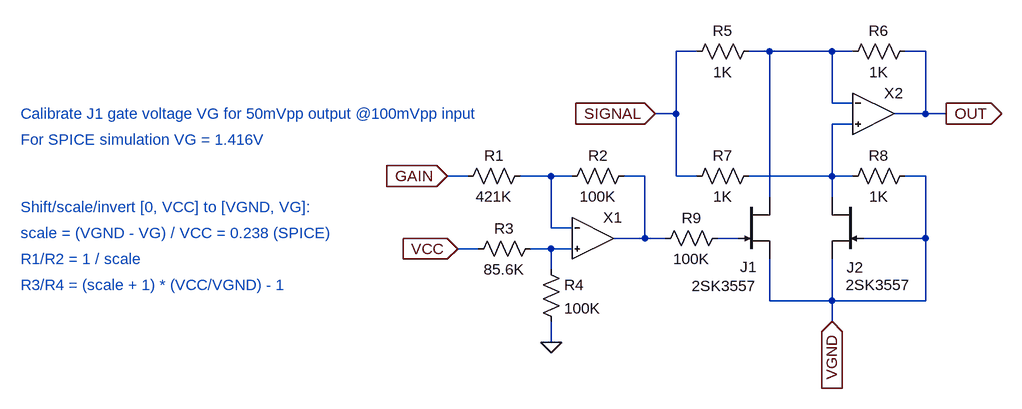
[diagram p0: schematic attenuator.asc]
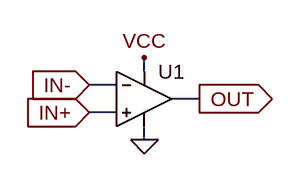
[diagram p1: sub-circuit opamp.asc]
attenuator.asc, the LTspice schematic file:
Version 4
SHEET 1 1100 728
WIRE -96 80 -128 80
WIRE 16 80 -16 80
WIRE 112 80 16 80
WIRE 144 80 112 80
WIRE 256 80 224 80
WIRE 112 160 112 80
WIRE 144 160 112 160
WIRE -128 176 -128 80
WIRE -128 176 -160 176
WIRE 256 176 256 80
WIRE 256 176 208 176
WIRE 288 176 256 176
WIRE 144 192 112 192
WIRE -448 272 -480 272
WIRE -320 272 -368 272
WIRE -288 272 -320 272
WIRE -176 272 -208 272
WIRE -128 272 -128 176
WIRE -96 272 -128 272
WIRE 112 272 112 192
WIRE 112 272 -16 272
WIRE 144 272 112 272
WIRE 256 272 224 272
WIRE 16 304 16 80
WIRE 112 304 112 272
WIRE -320 352 -320 272
WIRE -288 352 -320 352
WIRE -176 368 -176 272
WIRE -176 368 -224 368
WIRE -144 368 -176 368
WIRE -32 368 -64 368
WIRE 256 368 256 272
WIRE 256 368 160 368
WIRE -432 384 -464 384
WIRE -320 384 -352 384
WIRE -288 384 -320 384
WIRE -320 416 -320 384
WIRE 16 464 16 400
WIRE 112 464 112 400
WIRE 112 464 16 464
WIRE 256 464 256 368
WIRE 256 464 112 464
WIRE 112 496 112 464
WIRE -320 528 -320 496
FLAG 288 176 OUT
IOPIN 288 176 Out
FLAG -160 176 SIGNAL
IOPIN -160 176 In
FLAG -320 528 0
FLAG -480 272 GAIN
IOPIN -480 272 In
FLAG 112 496 VGND
IOPIN 112 496 In
FLAG -464 384 VCC
IOPIN -464 384 In
SYMBOL res 240 64 R90
WINDOW 0 0 56 VBottom 2
WINDOW 3 32 56 VTop 2
SYMATTR InstName R6
SYMATTR Value 1K
SYMBOL res 240 256 R90
WINDOW 0 0 56 VBottom 2
WINDOW 3 32 56 VTop 2
SYMATTR InstName R8
SYMATTR Value 1K
SYMBOL njf 160 304 M0
WINDOW 0 0 109 Left 2
WINDOW 3 -72 136 Left 2
SYMATTR InstName J2
SYMATTR Value 2SK3557
SYMBOL njf -32 304 R0
WINDOW 0 3 108 Left 2
WINDOW 3 -72 137 Left 2
SYMATTR InstName J1
SYMATTR Value 2SK3557
SYMBOL res 0 64 R90
WINDOW 0 0 56 VBottom 2
WINDOW 3 32 56 VTop 2
SYMATTR InstName R5
SYMATTR Value 1K
SYMBOL res 0 256 R90
WINDOW 0 0 56 VBottom 2
WINDOW 3 32 56 VTop 2
SYMATTR InstName R7
SYMATTR Value 1K
SYMBOL res -48 352 R90
WINDOW 0 0 56 VBottom 2
WINDOW 3 32 56 VTop 2
SYMATTR InstName R9
SYMATTR Value 100K
SYMBOL res -336 400 R0
SYMATTR InstName R4
SYMATTR Value 100K
SYMBOL res -336 368 R90
WINDOW 0 0 56 VBottom 2
WINDOW 3 32 56 VTop 2
SYMATTR InstName R3
SYMATTR Value 85.6K
SYMBOL res -192 256 R90
WINDOW 0 0 56 VBottom 2
WINDOW 3 32 56 VTop 2
SYMATTR InstName R2
SYMATTR Value 100K
SYMBOL res -352 256 R90
WINDOW 0 0 56 VBottom 2
WINDOW 3 32 56 VTop 2
SYMATTR InstName R1
SYMATTR Value 421K
SYMBOL opamp 176 176 R0
SYMATTR InstName X2
SYMBOL opamp -256 368 R0
SYMATTR InstName X1
TEXT -1136 176 Left 2 ;Calibrate J1 gate voltage VG for 50mVpp output @100mVpp input
TEXT -1136 320 Left 2 ;Shift/scale/invert [0, VCC] to [VGND, VG]:
TEXT -1136 216 Left 2 ;For SPICE simulation VG = 1.416V
TEXT -1136 360 Left 2 ;scale = (VGND - VG) / VCC = 0.238 (SPICE)
TEXT -1136 400 Left 2 ;R1/R2 = 1 / scale
TEXT -1136 440 Left 2 ;R3/R4 = (scale + 1) * (VCC/VGND) - 1

opamp.asc, the sub-circuit schematic file:
Version 4
SHEET 1 880 680
WIRE 144 144 144 128
WIRE 112 160 80 160
WIRE 208 176 176 176
WIRE 112 192 80 192
WIRE 144 224 144 208
FLAG 144 224 0
FLAG 144 128 VCC
FLAG 208 176 OUT
IOPIN 208 176 Out
FLAG 80 192 IN+
IOPIN 80 192 In
FLAG 80 160 IN-
IOPIN 80 160 In
SYMBOL Opamps\\UniversalOpamp2 144 176 R0
SYMATTR InstName U1
SYMATTR Value2 Avol=1Meg GBW=1.2Meg Slew=10Meg

The netlist it stands for:
* attenuator.asc
R6 OUT N001 1K
R8 VGND N002 1K
J2 N002 VGND VGND 2SK3557
J1 N001 N005 VGND 2SK3557
R5 N001 SIGNAL 1K
R7 N002 SIGNAL 1K
R9 N005 N004 100K
R4 N006 0 100K
R3 N006 VCC 85.6K
R2 N004 N003 100K
R1 N003 GAIN 421K
XX2 N002 N001 OUT opamp
XX1 N006 N003 N004 opamp

* block symbol definitions
.subckt opamp IN+ IN- OUT
XU1 IN+ IN- VCC 0 OUT level.2 Avol=1Meg GBW=1.2Meg Slew=10Meg ilimit=25m rail=0 Vos=0 phimargin=45 en=0 enk=0 in=0 ink=0 Rin=500Meg  ; pins IN+ IN- V+ V- OUT
.ends opamp

.model NJF NJF
.model PJF PJF
.lib standard.jft
* Calibrate J1 gate voltage VG for 50mVpp output @100mVpp input
* Shift/scale/invert [0, VCC] to [VGND, VG]:
* For SPICE simulation VG = 1.416V
* scale = (VGND - VG) / VCC = 0.238 (SPICE)
* R1/R2 = 1 / scale
* R3/R4 = (scale + 1) * (VCC/VGND) - 1
.lib UniversalOpamps2.sub
.backanno
.end